# EAGLE schematic HVAC8new (EAGLE 7.5.0)
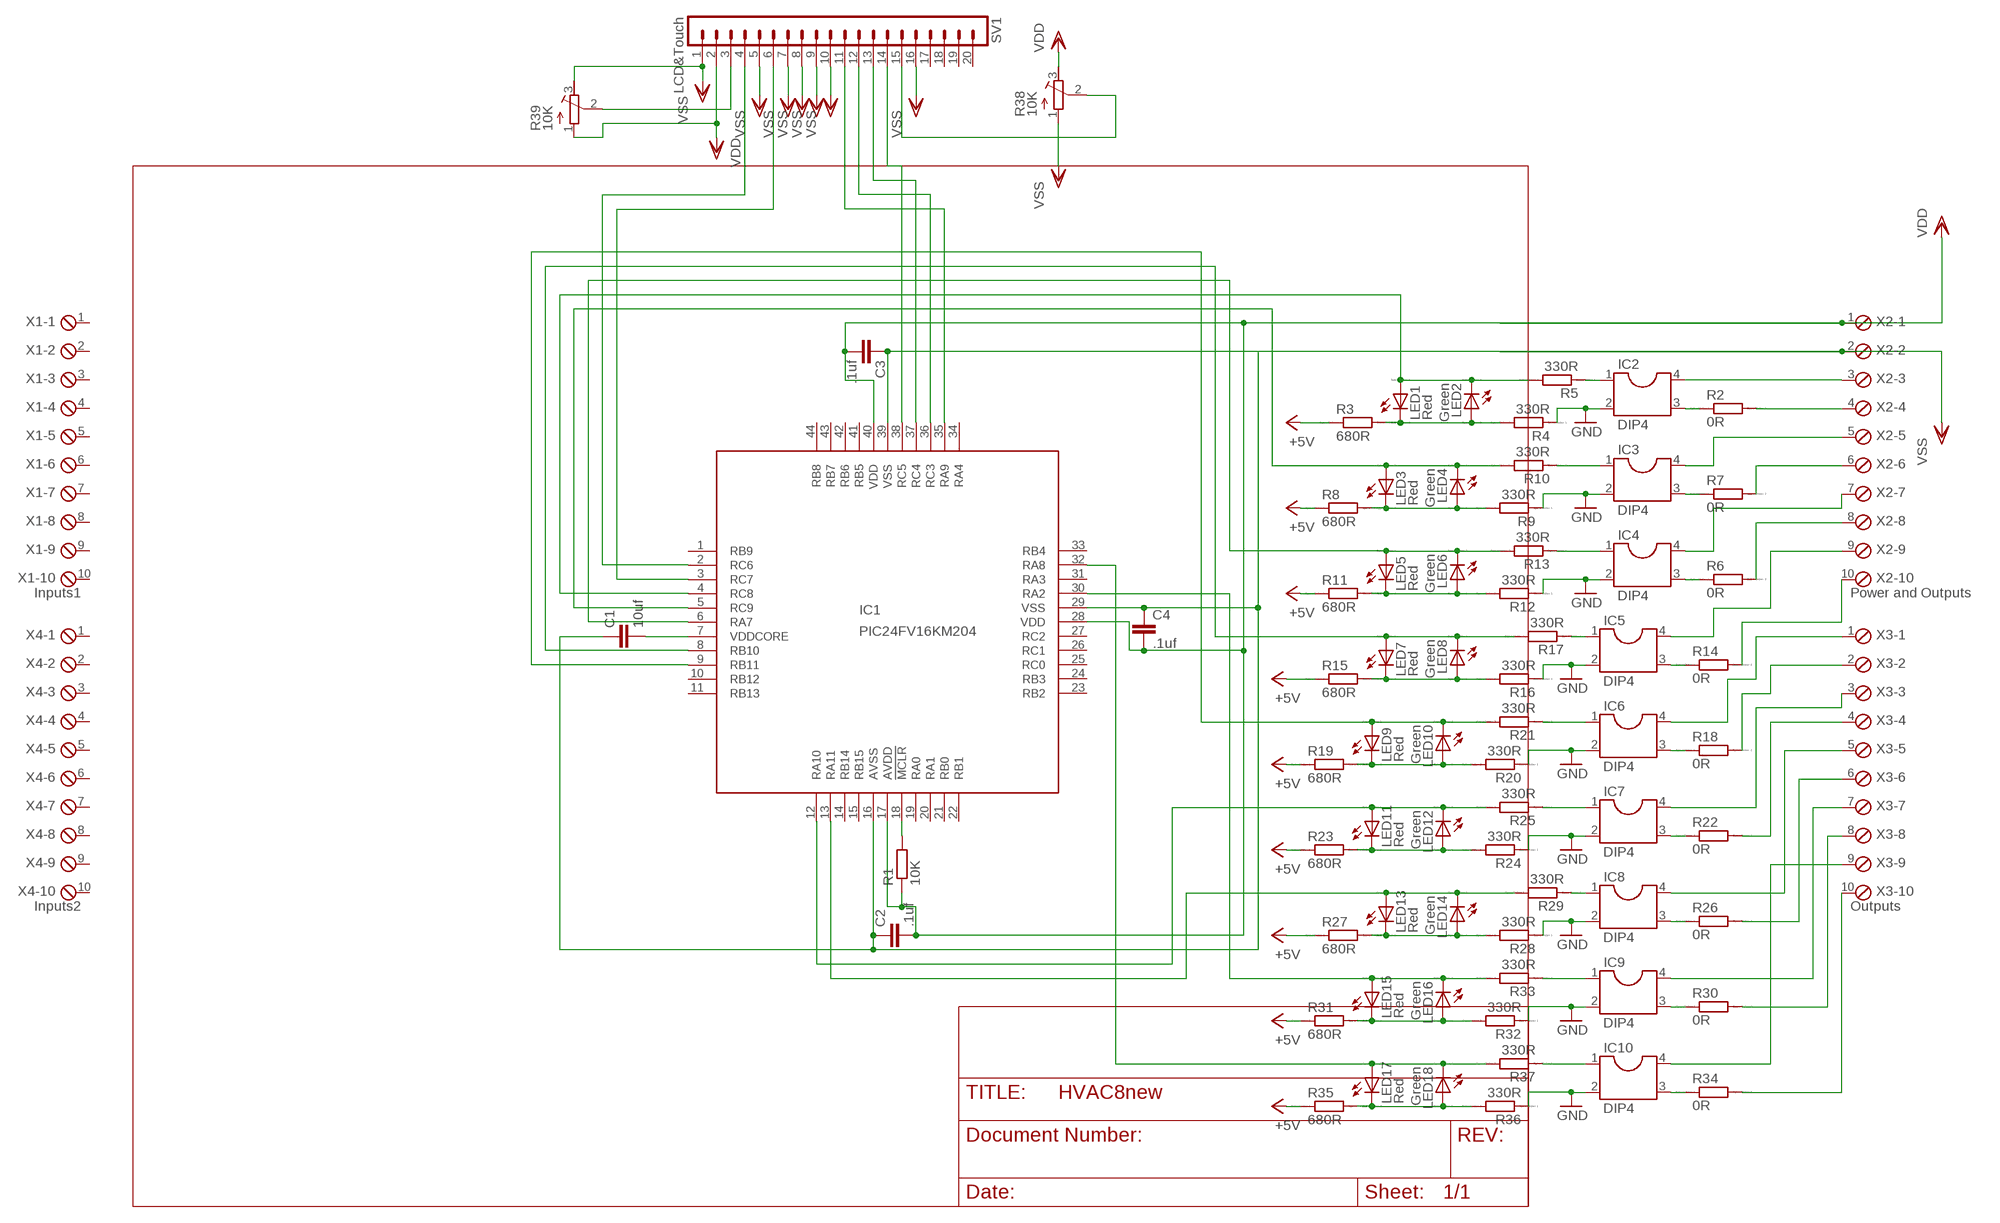
[diagram p0: schematic, sheet 1]

## Parts
C1  10uf  C-EUC1206  [C1206]
C2  .1uf  C-EUC1206  [C1206]
C3  .1uf  C-EUC1206  [C1206]
C4  .1uf  C-EUC1206  [C1206]
IC1  PIC24FV16KM204  [TQFP44]
IC2  DIP4  DIL4S  [SOCKET-04]
IC3  DIP4  DIL4S  [SOCKET-04]
IC4  DIP4  DIL4S  [SOCKET-04]
IC5  DIP4  DIL4S  [SOCKET-04]
IC6  DIP4  DIL4S  [SOCKET-04]
IC7  DIP4  DIL4S  [SOCKET-04]
IC8  DIP4  DIL4S  [SOCKET-04]
IC9  DIP4  DIL4S  [SOCKET-04]
IC10  DIP4  DIL4S  [SOCKET-04]
LED1  Red  LED_E  [LED_1206]
LED2  Green  LED_E  [LED_1206]
LED3  Red  LED_E  [LED_1206]
LED4  Green  LED_E  [LED_1206]
LED5  Red  LED_E  [LED_1206]
LED6  Green  LED_E  [LED_1206]
LED7  Red  LED_E  [LED_1206]
LED8  Green  LED_E  [LED_1206]
LED9  Red  LED_E  [LED_1206]
LED10  Green  LED_E  [LED_1206]
LED11  Red  LED_E  [LED_1206]
LED12  Green  LED_E  [LED_1206]
LED13  Red  LED_E  [LED_1206]
LED14  Green  LED_E  [LED_1206]
LED15  Red  LED_E  [LED_1206]
LED16  Green  LED_E  [LED_1206]
LED17  Red  LED_E  [LED_1206]
LED18  Green  LED_E  [LED_1206]
R1  10K  R-EU_R1206  [R1206]
R2  0R  RR1206  [R1206]
R3  680R  RR1206  [R1206]
R4  330R  RR1206  [R1206]
R5  330R  RR1206  [R1206]
R6  0R  RR1206  [R1206]
R7  0R  RR1206  [R1206]
R8  680R  RR1206  [R1206]
R9  330R  RR1206  [R1206]
R10  330R  RR1206  [R1206]
R11  680R  RR1206  [R1206]
R12  330R  RR1206  [R1206]
R13  330R  RR1206  [R1206]
R14  0R  RR1206  [R1206]
R15  680R  RR1206  [R1206]
R16  330R  RR1206  [R1206]
R17  330R  RR1206  [R1206]
R18  0R  RR1206  [R1206]
R19  680R  RR1206  [R1206]
R20  330R  RR1206  [R1206]
R21  330R  RR1206  [R1206]
R22  0R  RR1206  [R1206]
R23  680R  RR1206  [R1206]
R24  330R  RR1206  [R1206]
R25  330R  RR1206  [R1206]
R26  0R  RR1206  [R1206]
R27  680R  RR1206  [R1206]
R28  330R  RR1206  [R1206]
R29  330R  RR1206  [R1206]
R30  0R  RR1206  [R1206]
R31  680R  RR1206  [R1206]
R32  330R  RR1206  [R1206]
R33  330R  RR1206  [R1206]
R34  0R  RR1206  [R1206]
R35  680R  RR1206  [R1206]
R36  330R  RR1206  [R1206]
R37  330R  RR1206  [R1206]
R38  10K  R-TRIMM3296W  [RTRIM3296W]
R39  10K  R-TRIMM3296W  [RTRIM3296W]
SV1  LCD&Touch  MA20-1  [MA20-1]
X1  Inputs1  MPT10  [10POL254]
X2  Power and Outputs  MPT10  [10POL254]
X3  Outputs  MPT10  [10POL254]
X4  Inputs2  MPT10  [10POL254]

## Nets
+5V: R3.1 R8.1 R11.1 R15.1 R19.1 R23.1 R27.1 R31.1 R35.1
GND: IC2.2 IC3.2 IC4.2 IC5.2 IC6.2 IC7.2 IC8.2 IC9.2 IC10.2 R4.1 R9.1 R12.1 R16.1 R20.1 R24.1 R28.1 R32.1 R36.1
N$1: C1.2 IC1.7(VDDCORE)
N$2: IC1.18(!MCLR) R1.2
N$3: IC2.1 R5.1
N$4: IC1.5(RC9) LED3.A LED4.C R10.2
N$5: IC1.2(RC6) SV1.4
N$6: LED1.C LED2.A R3.2 R4.2
N$7: IC2.3 R2.1
N$8: IC3.1 R10.1
N$9: IC3.4 X2.5
N$10: R2.2 X2.4
N$11: LED3.C LED4.A R8.2 R9.2
N$12: IC3.3 R7.1
N$13: IC2.4 X2.3
N$14: R7.2 X2.6
N$15: IC4.1 R13.1
N$16: LED5.C LED6.A R11.2 R12.2
N$17: IC4.3 R6.1
N$18: IC1.6(RA7) LED5.A LED6.C R13.2
N$19: IC4.4 X2.7
N$20: R6.2 X2.8
N$21: IC5.1 R17.1
N$22: LED7.C LED8.A R15.2 R16.2
N$23: IC5.3 R14.1
N$24: IC6.1 R21.1
N$25: LED9.C LED10.A R19.2 R20.2
N$26: IC6.3 R18.1
N$27: IC5.4 X2.9
N$28: R14.2 X2.10
N$29: IC1.9(RB11) LED9.A LED10.C R21.2
N$30: IC6.4 X3.1
N$31: R18.2 X3.2
N$32: IC1.8(RB10) LED7.A LED8.C R17.2
N$33: IC7.1 R25.1
N$34: LED11.C LED12.A R23.2 R24.2
N$35: IC7.3 R22.1
N$36: IC1.12(RA10) LED11.A LED12.C R25.2
N$37: IC7.4 X3.3
N$38: R22.2 X3.4
N$39: IC8.1 R29.1
N$40: LED13.C LED14.A R27.2 R28.2
N$41: IC8.3 R26.1
N$42: IC9.1 R33.1
N$43: LED15.C LED16.A R31.2 R32.2
N$44: IC9.3 R30.1
N$45: IC1.30(RA2) LED15.A LED16.C R33.2
N$46: IC1.13(RA11) LED13.A LED14.C R29.2
N$47: IC10.1 R37.1
N$48: LED17.C LED18.A R35.2 R36.2
N$49: IC10.3 R34.1
N$50: IC1.32(RA8) LED17.A LED18.C R37.2
N$51: IC8.4 X3.5
N$52: R26.2 X3.6
N$53: IC9.4 X3.7
N$54: R30.2 X3.8
N$55: IC10.4 X3.9
N$56: R34.2 X3.10
N$57: IC1.4(RC8) LED1.A LED2.C R5.2
N$58: IC1.3(RC7) SV1.6
N$59: IC1.35(RA9) SV1.11
N$60: IC1.36(RC3) SV1.12
N$61: IC1.37(RC4) SV1.13
N$62: IC1.38(RC5) SV1.14
N$63: R39.2(S) SV1.3
N$64: R38.2(S) SV1.15
VDD: C2.2 C3.2 C4.2 IC1.17(AVDD) IC1.28(VDD) IC1.40(VDD) R1.1 R38.3(E) R39.1(A) SV1.2 X2.1
VSS: C1.1 C2.1 C3.1 C4.1 IC1.16(AVSS) IC1.29(VSS) IC1.39(VSS) R38.1(A) R39.3(E) SV1.1 SV1.5 SV1.7 SV1.8 SV1.9 SV1.10 SV1.16 X2.2
Unconnected: IC1.1(RB9) IC1.10(RB12) IC1.11(RB13) IC1.14(RB14) IC1.15(RB15) IC1.19(RA0) IC1.20(RA1) IC1.21(RB0) IC1.22(RB1) IC1.23(RB2) IC1.24(RB3) IC1.25(RC0) IC1.26(RC1) IC1.27(RC2) IC1.31(RA3) IC1.33(RB4) IC1.34(RA4) IC1.41(RB5) IC1.42(RB6) IC1.43(RB7) IC1.44(RB8) SV1.17 SV1.18 SV1.19 SV1.20 X1.1 X1.2 X1.3 X1.4 X1.5 X1.6 X1.7 X1.8 X1.9 X1.10 X4.1 X4.2 X4.3 X4.4 X4.5 X4.6 X4.7 X4.8 X4.9 X4.10

## Library data of the parts
C1-C4 = rcl:C-EU: CAPACITOR, European symbol
IC1 = microchip:PIC24FV16KM204: PIC24FV16KM204 TQFP-44 Auto generated by make-symbol-device-package-bsdl.ulp Rev. 25 Edited by Dave Source: PIC24FJ64GA004.bsd; MPN: PIC24FV16KM204; OC_FARNELL: 1332299; OC_NEWARK: 98M1927
IC2-IC10 = ic-package:DIL4: Dual In Line / Socket
LED1-LED18 = eagle-ltspice:LED_E: LED Source: http://www.osram.convergy.de Source: www.luxeon.com Source: www.kingbright.com; SPICEMODEL: NONE; SPICEPREFIX: D; SPICETYPE: diode
R1 = rcl:R-EU_: RESISTOR, European symbol
R2-R37 = eagle-ltspice:R: RESISTOR, European symbol; SPICEMODEL: NONE; SPICEPREFIX: R
R38 R39 = rcl:R-TRIMM: Trimm resistor
SV1 = con-lstb:MA20-1: PIN HEADER; OC_FARNELL: unknown; OC_NEWARK: unknown
X1-X4 = con-phoenix-254:MPT10: PHOENIX CONNECTOR; OC_FARNELL: unknown; OC_NEWARK: unknown